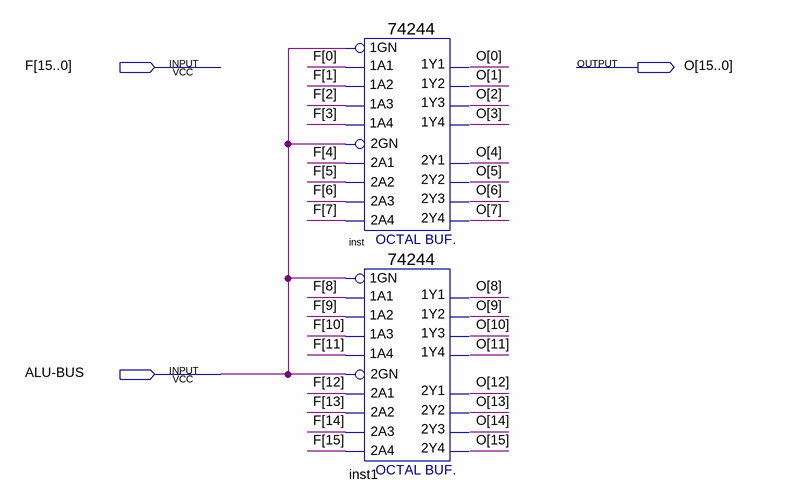
[diagram p0: schematic sheet]
// Quartus schematic ALU_tri.bdf as structural Verilog: 2 symbols, 3 pins
module ALU_tri (
  input  [15:0] F,
  input  \ALU-BUS ,
  output [15:0] O
);

  \74244  inst (
    .\1A2 (F[1]), .\1A4 (F[3]), .\1A1 (F[0]), .\1A3 (F[2]), .\1GN (\ALU-BUS ), .\2A3 (F[6]),
    .\2GN (\ALU-BUS ), .\2A1 (F[4]), .\2A4 (F[7]), .\2A2 (F[5]), .\1Y2 (O[1]), .\1Y4 (O[3]), .\2Y1 (O[4]),
    .\1Y1 (O[0]), .\2Y3 (O[6]), .\2Y4 (O[7]), .\1Y3 (O[2]), .\2Y2 (O[5]));
  \74244  inst1 (
    .\1A2 (F[9]), .\1A4 (F[11]), .\1A1 (F[8]), .\1A3 (F[10]), .\1GN (\ALU-BUS ), .\2A3 (F[14]),
    .\2GN (\ALU-BUS ), .\2A1 (F[12]), .\2A4 (F[15]), .\2A2 (F[13]), .\1Y2 (O[9]), .\1Y4 (O[11]),
    .\2Y1 (O[12]), .\1Y1 (O[8]), .\2Y3 (O[14]), .\2Y4 (O[15]), .\1Y3 (O[10]), .\2Y2 (O[13]));
endmodule
